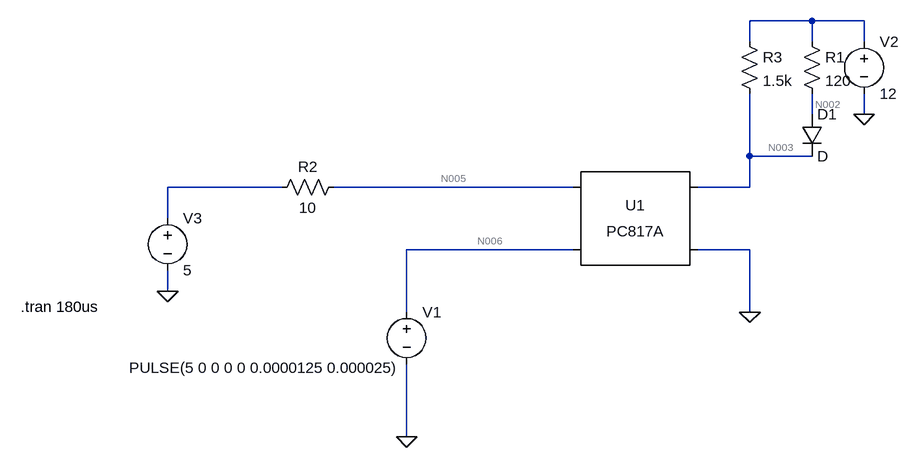
[diagram p0: schematic ltspice_octo100v.asc]
ltspice_octo100v.asc, the LTspice schematic file:
Version 4
SHEET 1 1240 680
WIRE 784 -320 688 -320
WIRE 864 -320 784 -320
WIRE 688 -288 688 -320
WIRE 784 -288 784 -320
WIRE 864 -288 864 -320
WIRE 784 -176 784 -208
WIRE 864 -176 864 -208
WIRE 688 -112 688 -208
WIRE 784 -112 688 -112
WIRE -32 -64 -208 -64
WIRE 416 -64 48 -64
WIRE 688 -64 688 -112
WIRE 688 -64 608 -64
WIRE -208 -16 -208 -64
WIRE 416 32 160 32
WIRE 688 32 608 32
WIRE -208 96 -208 64
WIRE 160 128 160 32
WIRE 688 128 688 32
WIRE 160 320 160 208
FLAG -208 96 0
FLAG 864 -176 0
FLAG 160 320 0
FLAG 688 128 0
SYMBOL voltage 160 112 R0
WINDOW 3 -9 102 Right 2
WINDOW 123 0 0 Left 0
WINDOW 39 0 0 Left 0
SYMATTR InstName V1
SYMATTR Value PULSE(5 0 0 0 0 0.0000125 0.000025)
SYMBOL Optos\\PC817A 512 -16 R0
SYMATTR InstName U1
SYMBOL voltage 864 -304 R0
WINDOW 123 0 0 Left 0
WINDOW 39 0 0 Left 0
SYMATTR InstName V2
SYMATTR Value 12
SYMBOL res 672 -304 R0
SYMATTR InstName R3
SYMATTR Value 1.5k
SYMBOL voltage -208 -32 R0
WINDOW 123 0 0 Left 0
WINDOW 39 0 0 Left 0
SYMATTR InstName V3
SYMATTR Value 5
SYMBOL res 64 -80 R90
WINDOW 0 0 56 VBottom 2
WINDOW 3 32 56 VTop 2
SYMATTR InstName R2
SYMATTR Value 10
SYMBOL diode 768 -176 R0
SYMATTR InstName D1
SYMBOL res 768 -304 R0
SYMATTR InstName R1
SYMATTR Value 120
TEXT -434 120 Left 2 !.tran 180us

The netlist it stands for:
* ltspice_octo100v.asc
V1 N006 0 PULSE(5 0 0 0 0 0.0000125 0.000025)
XU1 N005 N006 N003 0 PC817 Igain=1m
V2 N001 0 12
R3 N001 N003 1.5k
V3 N004 0 5
R2 N005 N004 10
D1 N002 N003 D
R1 N001 N002 120
.model D D
.lib standard.dio
.tran 180us
.lib PC817.sub
.backanno
.end

* Results of the author's LTspice run, read from the files saved beside the schematic
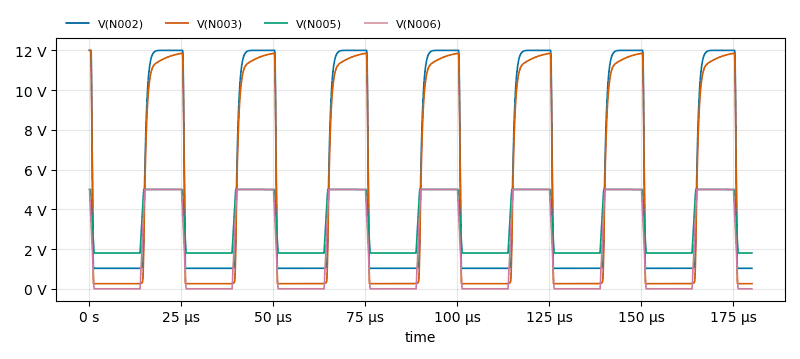
[diagram p1: Transient Analysis of ltspice_octo100v.asc, plotted from the saved traces]
* Transient Analysis, 1 run:
*   V(N002): min 1.03 V, max 12 V, average 5.531 V, rms 7.592 V, last 1.03 V
*   V(N003): min 257.6 mV, max 12 V, average 4.895 V, rms 7.266 V, last 257.6 mV
*   V(N005): min 1.801 V, max 5.002 V, average 3.249 V, rms 3.599 V, last 1.801 V
*   V(N006): min 0 V, max 5 V, average 2.205 V, rms 3.255 V, last 0 V